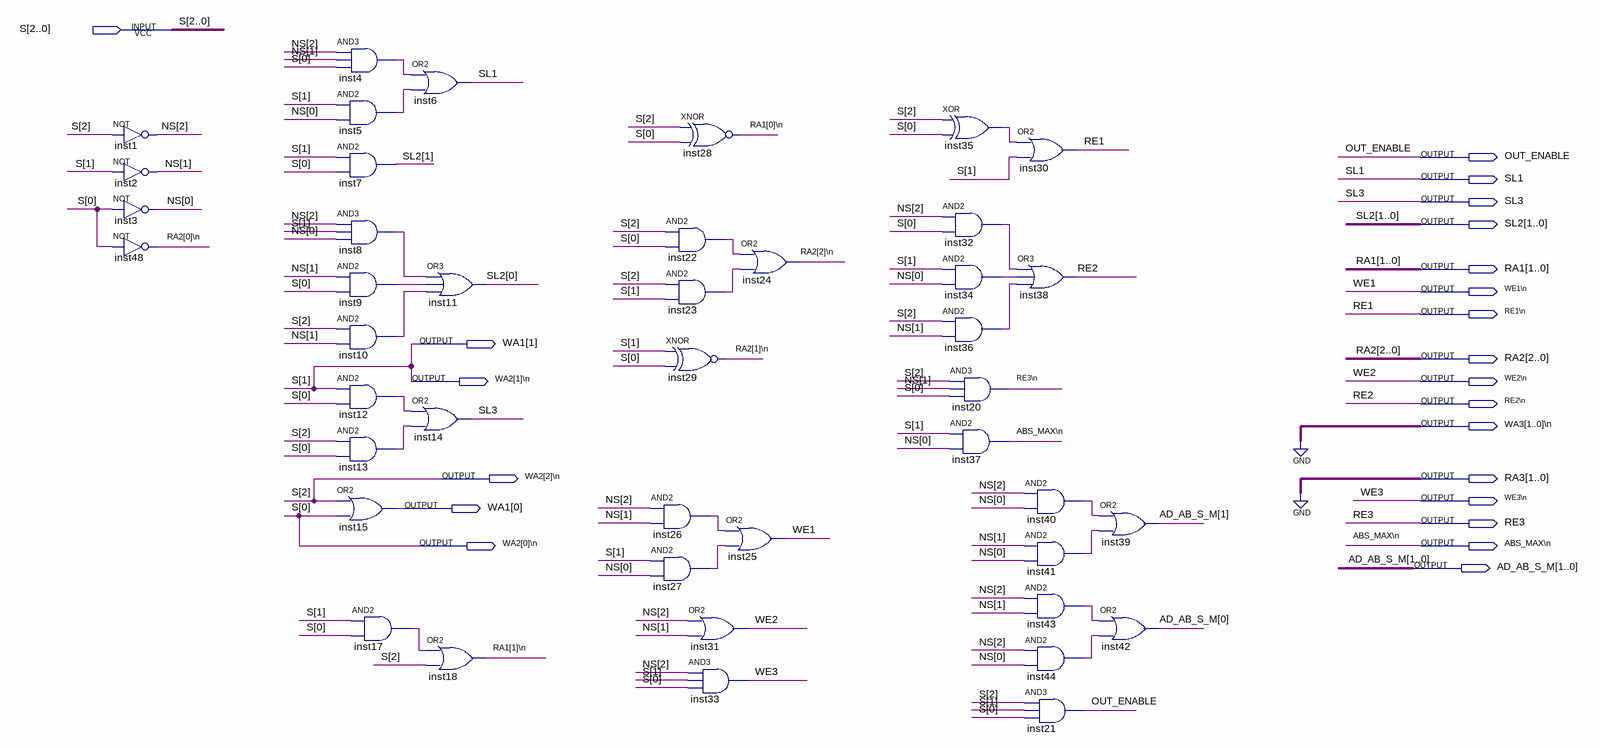
[diagram p0: schematic sheet]
// Quartus schematic SRA_Controller.bdf as structural Verilog: 43 symbols, 22 pins
module SRA_Controller (
  input  [2:0] S,
  output OUT_ENABLE,
  output SL1,
  output SL3,
  output [1:0] SL2,
  output [1:0] RA1,
  output \WE1\n ,
  output \RE1\n ,
  output [1:0] WA1,
  output [2:0] RA2,
  output \WA2[1]\n ,
  output \WE2\n ,
  output \RE2\n ,
  output \WA3[1..0]\n ,
  output \WA2[2]\n ,
  output [1:0] RA3,
  output \WE3\n ,
  output RE3,
  output \WA2[0]\n ,
  output \ABS_MAX\n ,
  output [1:0] AD_AB_S_M
);

  wire inst4_out, inst5_out, inst8_out, inst9_out, inst10_out, inst12_out, inst13_out, inst17_out,
       inst22_out, inst23_out, inst26_out, inst27_out, inst32_out, inst34_out, inst35_out, inst36_out,
       inst40_out, inst41_out, inst43_out, inst44_out, \RA1[0]\n , \RA1[1]\n , \RA2[0]\n , \RA2[1]\n ,
       \RA2[2]\n , \RE3\n ;
  wire [2:0] NS;

  not inst1 (NS[2], S[2]);
  not inst2 (NS[1], S[1]);
  not inst3 (NS[0], S[0]);
  not inst48 (\RA2[0]\n , S[0]);
  and inst4 (inst4_out, NS[2], NS[1], S[0]);
  and inst5 (inst5_out, S[1], NS[0]);
  and inst7 (SL2[1], S[1], S[0]);
  and inst8 (inst8_out, NS[2], S[1], NS[0]);
  and inst9 (inst9_out, NS[1], S[0]);
  and inst10 (inst10_out, S[2], NS[1]);
  and inst12 (inst12_out, S[1], S[0]);
  and inst13 (inst13_out, S[2], S[0]);
  or inst15 (WA1[0], S[2], S[0]);
  and inst17 (inst17_out, S[1], S[0]);
  or inst6 (SL1, inst4_out, inst5_out);
  or inst11 (SL2[0], inst8_out, inst9_out, inst10_out);
  or inst14 (SL3, inst12_out, inst13_out);
  or inst18 (\RA1[1]\n , inst17_out, S[2]);
  and inst22 (inst22_out, S[2], S[0]);
  and inst23 (inst23_out, S[2], S[1]);
  xnor inst29 (\RA2[1]\n , S[1], S[0]);
  and inst26 (inst26_out, NS[2], NS[1]);
  and inst27 (inst27_out, S[1], NS[0]);
  xnor inst28 (\RA1[0]\n , S[2], S[0]);
  or inst25 (\WE1\n , inst26_out, inst27_out);
  or inst31 (\WE2\n , NS[2], NS[1]);
  and inst33 (\WE3\n , NS[2], S[1], S[0]);
  or inst24 (\RA2[2]\n , inst22_out, inst23_out);
  xor inst35 (inst35_out, S[2], S[0]);
  and inst32 (inst32_out, NS[2], S[0]);
  and inst34 (inst34_out, S[1], NS[0]);
  and inst36 (inst36_out, S[2], NS[1]);
  and inst20 (\RE3\n , S[2], NS[1], S[0]);
  and inst37 (\ABS_MAX\n , S[1], NS[0]);
  or inst30 (\RE1\n , inst35_out, S[1]);
  or inst38 (\RE2\n , inst32_out, inst34_out, inst36_out);
  and inst40 (inst40_out, NS[2], NS[0]);
  and inst41 (inst41_out, NS[1], NS[0]);
  and inst43 (inst43_out, NS[2], NS[1]);
  and inst44 (inst44_out, NS[2], NS[0]);
  and inst21 (OUT_ENABLE, S[2], S[1], S[0]);
  or inst39 (AD_AB_S_M[1], inst40_out, inst41_out);
  or inst42 (AD_AB_S_M[0], inst43_out, inst44_out);

  assign RA3 = 2'b00;
  assign WA1[1] = S[1];
  assign \WA2[0]\n  = S[0];
  assign \WA2[1]\n  = S[1];
  assign \WA2[2]\n  = S[2];
  assign \WA3[1..0]\n  = 1'b0;

  // Other names for the same wires on the sheet: RE1 = \RE1\n ; RE2 = \RE2\n ; WE1 = \WE1\n ; WE2 = \WE2\n ;
  //   WE3 = \WE3\n 
endmodule
